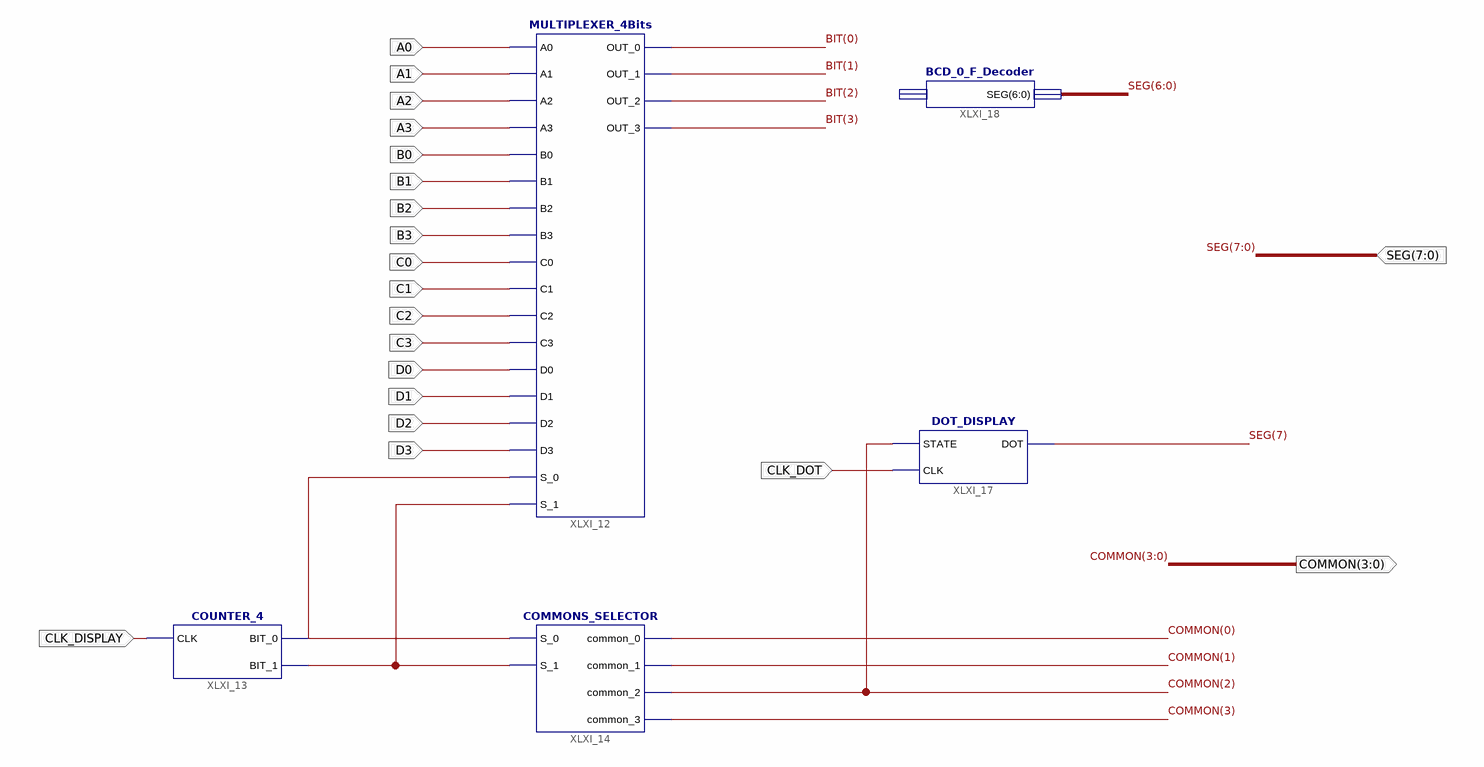
[diagram p0: schematic sheet 1]
// Xilinx ISE schematic DISPLAY.sch (spartan6) as structural Verilog: 5 symbols, 20 ports
module DISPLAY (
  input  D3,
  input  D2,
  input  D1,
  input  D0,
  input  C3,
  input  C2,
  input  C1,
  input  C0,
  input  B3,
  input  B2,
  input  B1,
  input  B0,
  input  A3,
  input  A2,
  input  A1,
  input  A0,
  input  CLK_DOT,
  input  CLK_DISPLAY,
  input  [7:0] SEG,
  output [3:0] COMMON
);

  wire XLXN_142, XLXN_144;
  wire [3:0] BIT;

  COUNTER_4 XLXI_13 (.BIT_0(XLXN_142), .BIT_1(XLXN_144), .CLK(CLK_DISPLAY));
  COMMONS_SELECTOR XLXI_14 (
    .S_0(XLXN_142), .S_1(XLXN_144), .common_0(COMMON[0]), .common_1(COMMON[1]), .common_2(COMMON[2]),
    .common_3(COMMON[3]));
  MULTIPLEXER_4Bits XLXI_12 (
    .A0(A0), .B0(B0), .C0(C0), .D0(D0), .A1(A1), .B1(B1), .C1(C1), .D1(D1), .A2(A2), .B2(B2), .C2(C2),
    .D2(D2), .A3(A3), .B3(B3), .C3(C3), .D3(D3), .S_0(XLXN_142), .S_1(XLXN_144), .OUT_0(BIT[0]),
    .OUT_1(BIT[1]), .OUT_2(BIT[2]), .OUT_3(BIT[3]));
  DOT_DISPLAY XLXI_17 (.CLK(CLK_DOT), .DOT(SEG[7]), .STATE(COMMON[2]));
  BCD_0_F_Decoder XLXI_18 (.SEG(SEG[6:0]));  // open: BIT
endmodule
